# EAGLE board module (EAGLE 9.6.2), part 1 of 2
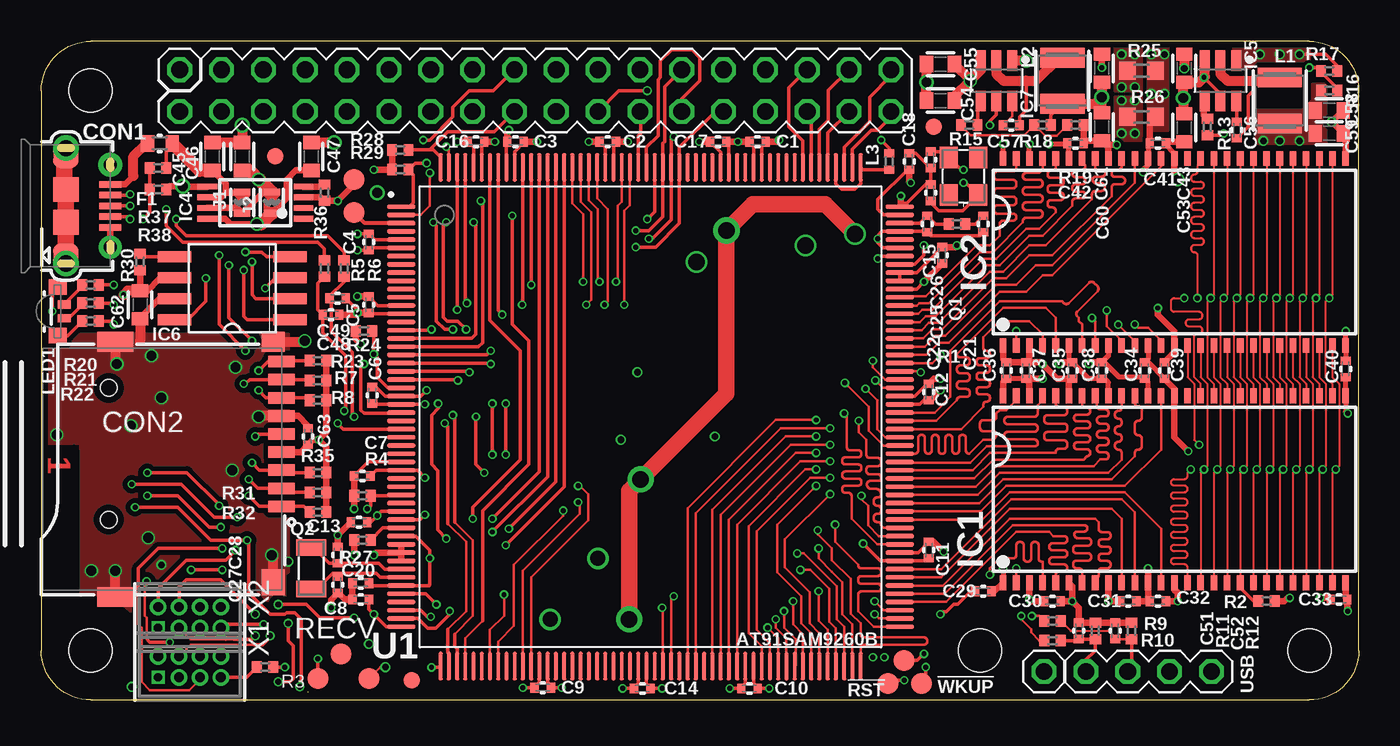
[diagram p5: board, top side]
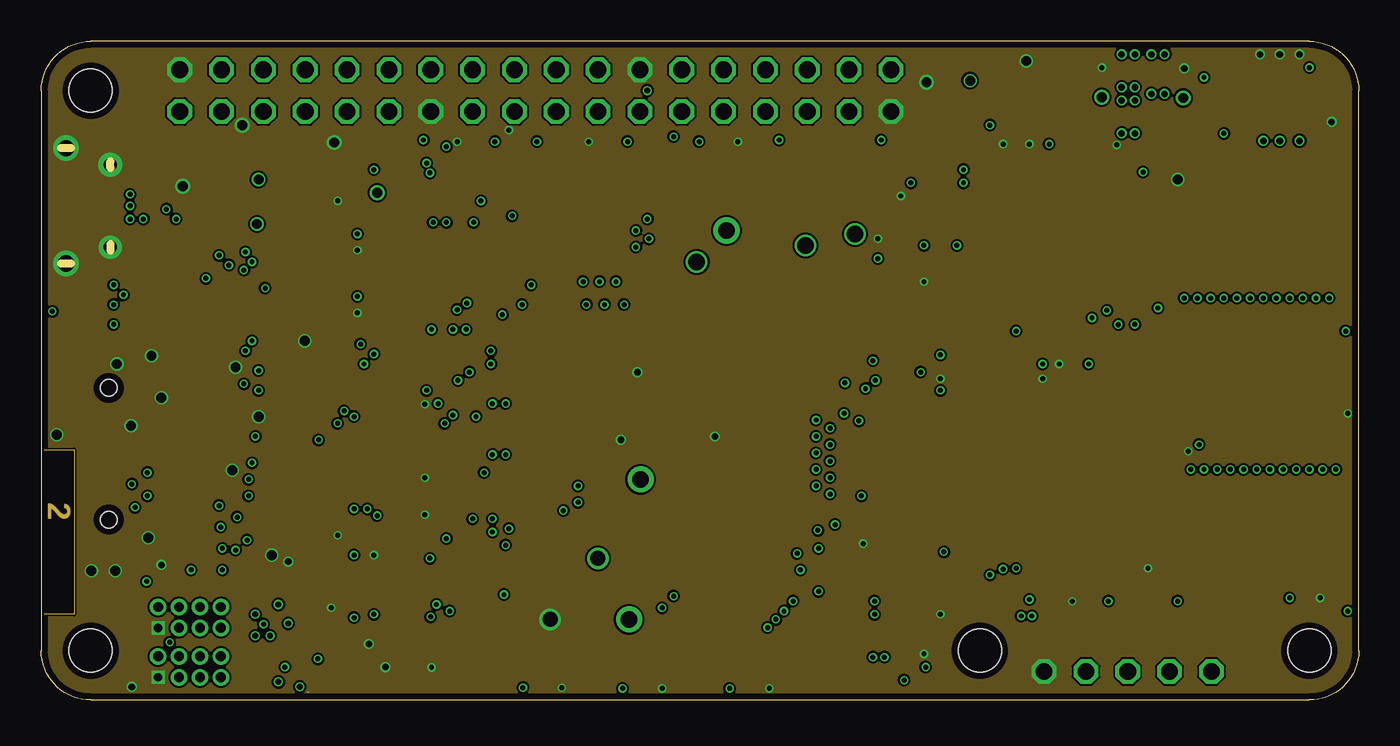
[diagram p6: board, inner layer Route2]
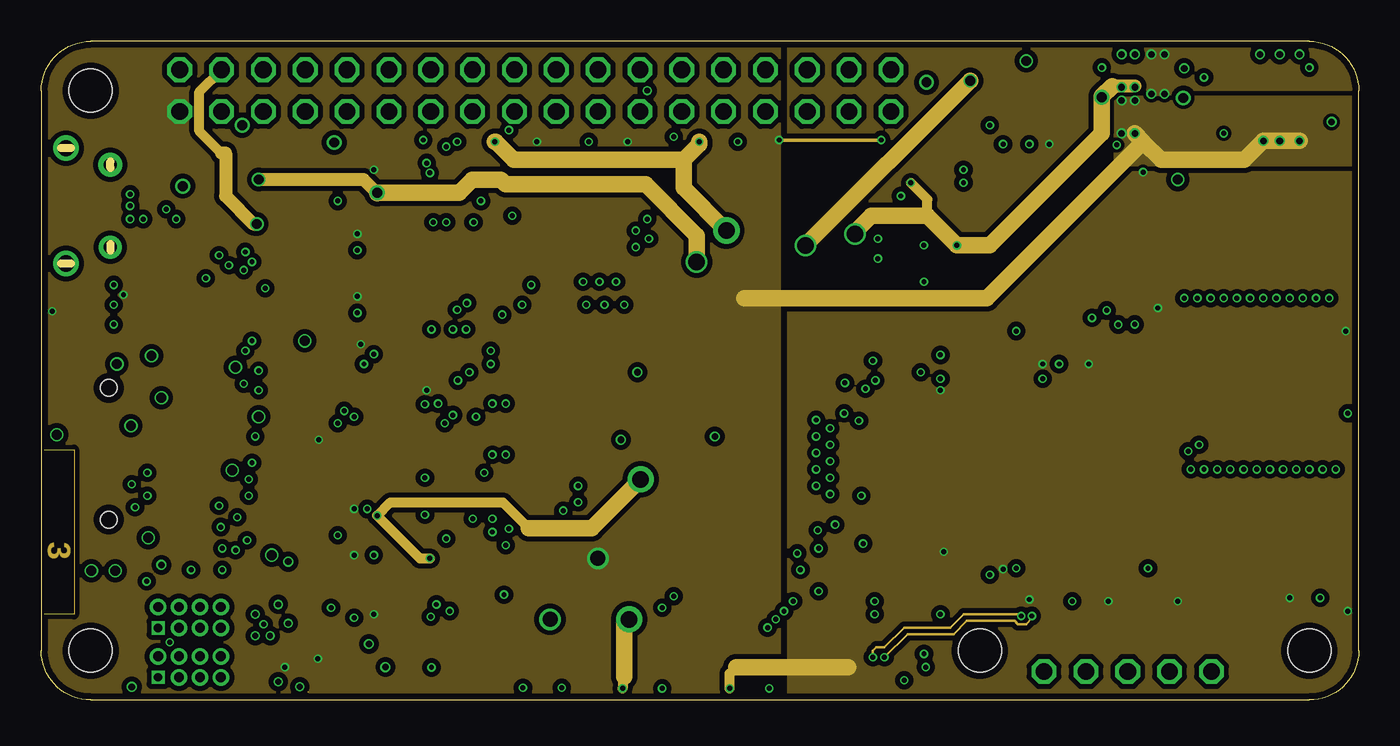
[diagram p7: board, inner layer Route15]
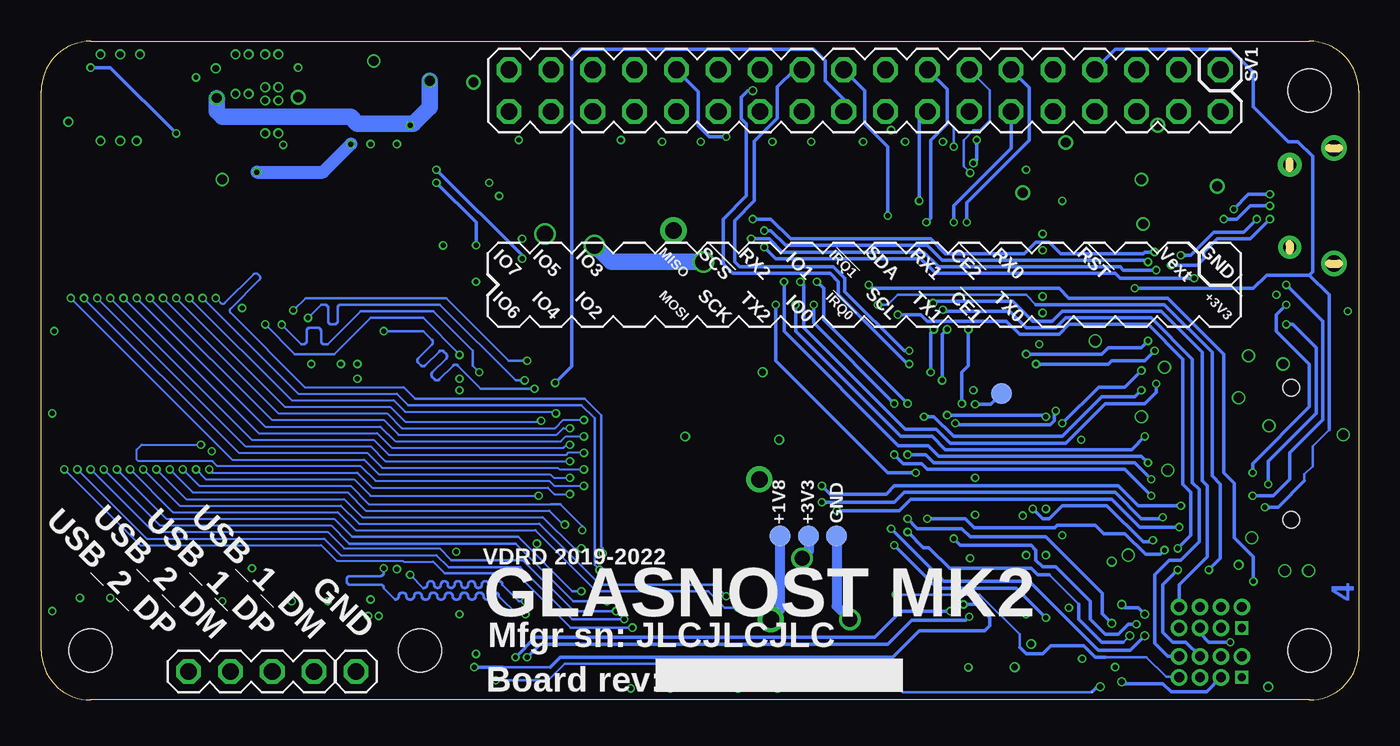
[diagram p8: board, bottom side, seen from below]

Size 80 x 40 mm. Coordinates in mm from the lower left corner, seen from the top.
Outline: 3,0 77,0 arc90 80,3 80,37 arc90 77,40 3,40 arc90 0,37 0,3 arc90 3,0
Copper layers (1+2*15+16): Top 0.035mm / dielectric 0.2mm / Route2 0.0175mm / dielectric 0.465mm / Route15 0.0175mm / dielectric 0.2mm / Bottom 0.035mm
Design rules "default *": minimum track width 5mil, minimum drill 0.2mm, track to track 5mil, track to pad 5mil, pad to pad 5mil, via to via 5mil, smd to smd 5mil, copper to edge 0.4mm, drill to drill 6mil, minimum pad ring 4mil, minimum via ring 4mil, stop-mask expansion 0.1mm, vias tented up to drill 0.4mm, thermal gap 10mil
Holes 2.6 mm at 3,37 3,3 77,3 57,3
tRestrict: area 0,34 to 6,40; area 0,0 to 6,6; area 74,0 to 80,6; area 54,0 to 60,6; area 0,5.2 to 2,15.2
bRestrict: area 0,34 to 6,40; area 0,0 to 6,6; area 74,0 to 80,6; area 54,0 to 60,6; area 0,5.2 to 2,15.2

## Footprints (pad centres in the part's own frame; a part is rotated, then mirrored left to right if it is on the bottom)
B1,27 = smd 1.27 x 1.27: TP 0,0
C0402K = smd 0.5 x 0.6: 1 -0.5,0; 2 0.5,0
C0603 = smd 0.8 x 1: 1 -0.85,0; 2 0.85,0
10118194 = smd 0.4 x 1.35: 1 -1.3,2.7; 2 -0.65,2.7; 3 0,2.7; 4 0.65,2.7; 5 1.3,2.7 | drill 0.8 pad 1.45: SH1 -2.5,2.7 | drill 0.8 pad 1.4: SH2 2.5,2.7 | drill 1 pad 1.55: SH3 -3.5,0; SH8 3.5,0 | smd 1.5 x 1.55: SH4 -3.05,0; SH5 -1,0; SH6 1,0; SH7 3.05,0
112J = smd 1.2 x 1.4: GND1 -7.75,-0.5 | smd 1.2 x 2.2: GND2 -7.75,-10.1; GND3 7.75,-10.1 | smd 1.6 x 1.4: GND4 6.85,-0.5 | smd 0.7 x 1.6: P$1 2.25,0; P$2 1.15,0; P$3 0.05,0; P$4 -1.05,0; P$5 -2.15,0; P$6 -3.25,0; P$7 -4.35,0; P$8 -5.45,0; P$13 -6.55,0 | hole 1: -4.95,-10.5; 3.05,-10.5
F0603 = smd 0.8 x 1: 1 -0.75,0; 2 0.75,0
TSOP54-400 = smd 0.4 x 0.9: 1 -10.4,-5.68; 2 -9.6,-5.68; 3 -8.8,-5.68; 4 -8,-5.68; 5 -7.2,-5.68; 6 -6.4,-5.68; 7 -5.6,-5.68; 8 -4.8,-5.68; 9 -4,-5.68; 10 -3.2,-5.68; 11 -2.4,-5.68; 12 -1.6,-5.68; 13 -0.8,-5.68; 14 0,-5.68; 15 0.8,-5.68; 16 1.6,-5.68; 17 2.4,-5.68; 18 3.2,-5.68; 19 4,-5.68; 20 4.8,-5.68; 21 5.6,-5.68; 22 6.4,-5.68; 23 7.2,-5.68; 24 8,-5.68; 25 8.8,-5.68; 26 9.6,-5.68; 27 10.4,-5.68; 28 10.4,5.68; 29 9.6,5.68; 30 8.8,5.68; 31 8,5.68; 32 7.2,5.68; 33 6.4,5.68; 34 5.6,5.68; 35 4.8,5.68; 36 4,5.68; 37 3.2,5.68; 38 2.4,5.68; 39 1.6,5.68; 40 0.8,5.68; 41 0,5.68; 42 -0.8,5.68; 43 -1.6,5.68; 44 -2.4,5.68; 45 -3.2,5.68; 46 -4,5.68; 47 -4.8,5.68; 48 -5.6,5.68; 49 -6.4,5.68; 50 -7.2,5.68; 51 -8,5.68; 52 -8.8,5.68; 53 -9.6,5.68; 54 -10.4,5.68
TSSOP8 = smd 1.2 x 0.35: 1 -2.925,0.975; 2 -2.925,0.325; 3 -2.925,-0.325; 4 -2.925,-0.975; 5 2.925,-0.975; 6 2.925,-0.325; 7 2.925,0.325; 8 2.925,0.975
SOT95P280X110-6 = smd 1.259 x 0.609: 1 -1.228,0.95; 2 -1.228,0; 3 -1.228,-0.95; 4 1.228,-0.95; 5 1.228,0; 6 1.228,0.95
SO08-208 = smd 0.66 x 2.032: 1 -1.905,-3.498; 2 -0.635,-3.498; 3 0.635,-3.498; 4 1.905,-3.498; 5 1.905,3.498; 6 0.635,3.498; 7 -0.635,3.498; 8 -1.905,3.498
C0603' = smd 0.4 x 1: 1 -0.65,0; 2 0.65,0
L3230M = smd 1.2 x 2.7: 1 -1.4,0; 2 1.4,0
L0402 = smd 0.5 x 0.6: 1 -0.5,0; 2 0.5,0
321015RGB = smd 0.5 x 0.8: 1 -0.415,0.4; 4 0.415,0.4 | smd 0.95 x 1.1: 2 -1.475,0; 3 1.475,0
3215 = smd 1.3 x 1.1: 1 -1.15,-0.9; 2 1.15,-0.9; 3 1.15,0.9; 4 -1.15,0.9
3215' = smd 1 x 1.8: 1 -1.25,0; 2 1.25,0
R0402 = smd 0.6 x 0.7: 1 -0.5,0; 2 0.5,0
R0603 = smd 1 x 1.1: 1 -0.85,0; 2 0.85,0
MA18-2 = drill 1.016 pad 1.5 octagon: 1 -21.59,-1.27; 2 -21.59,1.27; 3 -19.05,-1.27; 4 -19.05,1.27; 5 -16.51,-1.27; 6 -16.51,1.27; 7 -13.97,-1.27; 8 -13.97,1.27; 9 -11.43,-1.27; 10 -11.43,1.27; 11 -8.89,-1.27; 12 -8.89,1.27; 13 -6.35,-1.27; 14 -6.35,1.27; 15 -3.81,-1.27; 16 -3.81,1.27; 17 -1.27,-1.27; 18 -1.27,1.27; 19 1.27,-1.27; 20 1.27,1.27; 21 3.81,-1.27; 22 3.81,1.27; 23 6.35,-1.27; 24 6.35,1.27; 25 8.89,-1.27; 26 8.89,1.27; 27 11.43,-1.27; 28 11.43,1.27; 29 13.97,-1.27; 30 13.97,1.27; 31 16.51,-1.27; 32 16.51,1.27; 33 19.05,-1.27; 34 19.05,1.27; 35 21.59,-1.27; 36 21.59,1.27
QFP50P3120X3120X410-208N = smd 1.74 x 0.28: 1 -15.14,12.75; 2 -15.14,12.25; 3 -15.14,11.75; 4 -15.14,11.25; 5 -15.14,10.75; 6 -15.14,10.25; 7 -15.14,9.75; 8 -15.14,9.25; 9 -15.14,8.75; 10 -15.14,8.25; 11 -15.14,7.75; 12 -15.14,7.25; 13 -15.14,6.75; 14 -15.14,6.25; 15 -15.14,5.75; 16 -15.14,5.25; 17 -15.14,4.75; 18 -15.14,4.25; 19 -15.14,3.75; 20 -15.14,3.25; 21 -15.14,2.75; 22 -15.14,2.25; 23 -15.14,1.75; 24 -15.14,1.25; 25 -15.14,0.75; 26 -15.14,0.25; 27 -15.14,-0.25; 28 -15.14,-0.75; 29 -15.14,-1.25; 30 -15.14,-1.75; 31 -15.14,-2.25; 32 -15.14,-2.75; 33 -15.14,-3.25; 34 -15.14,-3.75; 35 -15.14,-4.25; 36 -15.14,-4.75; 37 -15.14,-5.25; 38 -15.14,-5.75; 39 -15.14,-6.25; 40 -15.14,-6.75; 41 -15.14,-7.25; 42 -15.14,-7.75; 43 -15.14,-8.25; 44 -15.14,-8.75; 45 -15.14,-9.25; 46 -15.14,-9.75; 47 -15.14,-10.25; 48 -15.14,-10.75; 49 -15.14,-11.25; 50 -15.14,-11.75; 51 -15.14,-12.25; 52 -15.14,-12.75; 105 15.14,-12.75; 106 15.14,-12.25; 107 15.14,-11.75; 108 15.14,-11.25; 109 15.14,-10.75; 110 15.14,-10.25; 111 15.14,-9.75; 112 15.14,-9.25; 113 15.14,-8.75; 114 15.14,-8.25; 115 15.14,-7.75; 116 15.14,-7.25; 117 15.14,-6.75; 118 15.14,-6.25; 119 15.14,-5.75; 120 15.14,-5.25; 121 15.14,-4.75; 122 15.14,-4.25; 123 15.14,-3.75; 124 15.14,-3.25; 125 15.14,-2.75; 126 15.14,-2.25; 127 15.14,-1.75; 128 15.14,-1.25; 129 15.14,-0.75; 130 15.14,-0.25; 131 15.14,0.25; 132 15.14,0.75; 133 15.14,1.25; 134 15.14,1.75; 135 15.14,2.25; 136 15.14,2.75; 137 15.14,3.25; 138 15.14,3.75; 139 15.14,4.25; 140 15.14,4.75; 141 15.14,5.25; 142 15.14,5.75; 143 15.14,6.25; 144 15.14,6.75; 145 15.14,7.25; 146 15.14,7.75; 147 15.14,8.25; 148 15.14,8.75; 149 15.14,9.25; 150 15.14,9.75; 151 15.14,10.25; 152 15.14,10.75; 153 15.14,11.25; 154 15.14,11.75; 155 15.14,12.25; 156 15.14,12.75 | smd 0.28 x 1.74: 53 -12.75,-15.14; 54 -12.25,-15.14; 55 -11.75,-15.14; 56 -11.25,-15.14; 57 -10.75,-15.14; 58 -10.25,-15.14; 59 -9.75,-15.14; 60 -9.25,-15.14; 61 -8.75,-15.14; 62 -8.25,-15.14; 63 -7.75,-15.14; 64 -7.25,-15.14; 65 -6.75,-15.14; 66 -6.25,-15.14; 67 -5.75,-15.14; 68 -5.25,-15.14; 69 -4.75,-15.14; 70 -4.25,-15.14; 71 -3.75,-15.14; 72 -3.25,-15.14; 73 -2.75,-15.14; 74 -2.25,-15.14; 75 -1.75,-15.14; 76 -1.25,-15.14; 77 -0.75,-15.14; 78 -0.25,-15.14; 79 0.25,-15.14; 80 0.75,-15.14; 81 1.25,-15.14; 82 1.75,-15.14; 83 2.25,-15.14; 84 2.75,-15.14; 85 3.25,-15.14; 86 3.75,-15.14; 87 4.25,-15.14; 88 4.75,-15.14; 89 5.25,-15.14; 90 5.75,-15.14; 91 6.25,-15.14; 92 6.75,-15.14; 93 7.25,-15.14; 94 7.75,-15.14; 95 8.25,-15.14; 96 8.75,-15.14; 97 9.25,-15.14; 98 9.75,-15.14; 99 10.25,-15.14; 100 10.75,-15.14; 101 11.25,-15.14; 102 11.75,-15.14; 103 12.25,-15.14; 104 12.75,-15.14; 157 12.75,15.14; 158 12.25,15.14; 159 11.75,15.14; 160 11.25,15.14; 161 10.75,15.14; 162 10.25,15.14; 163 9.75,15.14; 164 9.25,15.14; 165 8.75,15.14; 166 8.25,15.14; 167 7.75,15.14; 168 7.25,15.14; 169 6.75,15.14; 170 6.25,15.14; 171 5.75,15.14; 172 5.25,15.14; 173 4.75,15.14; 174 4.25,15.14; 175 3.75,15.14; 176 3.25,15.14; 177 2.75,15.14; 178 2.25,15.14; 179 1.75,15.14; 180 1.25,15.14; 181 0.75,15.14; 182 0.25,15.14; 183 -0.25,15.14; 184 -0.75,15.14; 185 -1.25,15.14; 186 -1.75,15.14; 187 -2.25,15.14; 188 -2.75,15.14; 189 -3.25,15.14; 190 -3.75,15.14; 191 -4.25,15.14; 192 -4.75,15.14; 193 -5.25,15.14; 194 -5.75,15.14; 195 -6.25,15.14; 196 -6.75,15.14; 197 -7.25,15.14; 198 -7.75,15.14; 199 -8.25,15.14; 200 -8.75,15.14; 201 -9.25,15.14; 202 -9.75,15.14; 203 -10.25,15.14; 204 -10.75,15.14; 205 -11.25,15.14; 206 -11.75,15.14; 207 -12.25,15.14; 208 -12.75,15.14
FIDUCIAL_1MM = smd 1 x 1: 1 0,0
MA05-1 = drill 1.016 pad 1.5 octagon: 1 -5.08,0; 2 -2.54,0; 3 0,0; 4 2.54,0; 5 5.08,0
050_610_HN-5/10 = drill 0.5 pad 0.8 square: 1 0,0 | drill 0.6 pad 1: 2 0,1.27; 3 1.27,0; 4 1.27,1.27; 5 2.54,0; 6 2.54,1.27; 7 3.81,0; 8 3.81,1.27

## Placement (x,y rotation side)
!RST  PTR1B1,27  [B1,27]  51.4,1 0 top
!WKUP  PTR1B1,27  [B1,27]  53.45,1 0 top
+1V1  PTR1B1,27  [B1,27]  19,29.6 0 top
+1V8  PTR1B1,27  [B1,27]  35.15,9.95 270 bottom
+3V3  PTR1B1,27  [B1,27]  33.4,9.95 270 bottom
+3V3@99  PTR1B1,27  [B1,27]  16.8,1.3 0 top
C1  100nF  [C0402K]  43.5,33.9 180 top
C2  100nF  [C0402K]  34.4,33.9 180 top
C3  100nF  [C0402K]  28.8,33.9 180 top
C4  100nF  [C0402K]  19.9,27.8 270 top
C5  100nF  [C0402K]  19.9,24 270 top
C6  100nF  [C0402K]  20.1,18.5 270 top
C7  100nF  [C0402K]  19.5,13.6 0 top
C8  100nF  [C0402K]  19.4,6.1 180 top
C9  100nF  [C0402K]  30.45,0.75 0 top
C10  100nF  [C0402K]  43,0.7 0 top
C11  100nF  [C0402K]  53.9,9.1 270 top
C12  100nF  [C0402K]  53.9,18.7 90 top
C13  100nF  [C0402K]  19.3,10.8 180 top
C14  100nF  [C0402K]  36.5,0.7 0 top
C15  100nF  [C0402K]  54.7,27 270 top
C16  100nF  [C0402K]  26.4,33.9 180 top
C17  100nF  [C0402K]  41.1,33.9 0 top
C18  100nF  [C0402K]  52.7,32.7 90 top
C20  100nF  [C0402K]  19.4,7.1 180 top
C21  10nF  [C0402K]  57.2,28.9 270 top
C22  1nF  [C0402K]  53.8,28.9 270 top
C25  9pF  [C0402K]  54,30.8 90 top
C26  9pF  [C0402K]  54,32.8 270 top
C27  15pF  [C0402K]  18,7 270 top
C28  15pF  [C0402K]  18,8.8 90 top
C29  100nF  [C0402K]  57.2,6.6 180 top
C30  100nF  [C0402K]  61.4,6 0 top
C31  100nF  [C0402K]  66,6 0 top
C32  100nF  [C0402K]  67.8,6 180 top
C33  100nF  [C0402K]  78.8,6.1 180 top
C34  100nF  [C0402K]  67,20 90 top
C35  100nF  [C0402K]  62.6,20 90 top
C36  100nF  [C0402K]  58.6,20 270 top
C37  100nF  [C0402K]  59.8,20 270 top
C38  100nF  [C0402K]  64.4,20 270 top
C39  100nF  [C0402K]  68.2,20 270 top
C40  100nF  [C0402K]  79.2,20.1 270 top
C41  100nF  [C0402K]  67.8,33.8 0 top
C42  100nF  [C0402K]  62.8,33.8 0 top
C43  10uF  [C0603]  69.4,38.35 90 top
C45  10uF  [C0603]  10.4,33 90 top
C46  10uF  [C0603]  12.2,33 90 top
C47  10uF  [C0603]  16.4,33 90 top
C48  15pF  [C0402K]  17.6,23.4 0 top
C49  15pF  [C0402K]  18,24.4 0 top
C51  15pF  [C0402K]  63,4.2 90 top
C52  15pF  [C0402K]  65.2,4.2 90 top
C53  10uF  [C0603]  69.4,34.75 270 top
C54  10uF  [C0603]  54.6,36.4 180 top
C55  10uF  [C0603]  54.6,38.6 180 top
C56  1uF  [C0402K]  72.6,34.6 270 top
C57  1uF  [C0402K]  58.9,34.9 0 top
C58  10uF  [C0603]  78.2,35.8 0 top
C59  10uF  [C0603]  78.2,34.4 0 top
C60  10uF  [C0603]  64.4,34.8 270 top
C61  10uF  [C0603]  64.4,38.35 90 top
C62  1uF  [C0603]  6,24 270 top
C63  100nF  [C0402K]  16.2,16 90 top
CON1  microusb  [10118194]  1.5,30 270 top
CON2  microsd  [112J]  14.6,14 270 top
F1  500mA  [F0603]  7.2,33.8 0 top
GND  PTR1B1,27  [B1,27]  31.7,9.95 270 bottom
GND15  PTR1B1,27  [B1,27]  19,31.6 0 top
GND99  PTR1B1,27  [B1,27]  19.9,1.3 0 top
IC1  MT48LC16M16A2  [TSOP54-400]  68.8,12.8 0 top
IC2  MT48LC16M16A2  [TSOP54-400]  68.8,27.2 0 top
IC4  tps2115a  [TSSOP8]  13,30.2 180 top
IC5  [SOT95P280X110-6]  71.6,37.6 270 top
IC6  AT45DB-S  [SO08-208]  11.6,25 90 top
IC7  [SOT95P280X110-6]  58,37.6 270 top
J1  JUMP-0603  [C0603']  12.2,30.2 270 top
J2  JUMP-0603  [C0603']  14,30.2 270 top
L1  4.7uH  [L3230M]  75.2,36.4 270 top
L2  2.2uH  [L3230M]  62,37.6 270 top
L3  300Ohm  [L0402]  51.5,32.7 270 top
LED1  [321015RGB]  1,23.6 270 top
Q1  18.432MHz  [3215]  56,31.8 90 top
Q2  32.768kHz  [3215']  16.4,8 90 top
R1  1k  [R0402]  55.6,28.9 180 top
R2  470k  [R0402]  74.4,6 0 top
R3  47k  [R0402]  13.6,2 0 top
R4  47k  [R0402]  19.5,12.4 0 top
R5  27  [R0402]  17.2,26.2 270 top
R6  27  [R0402]  18.4,26.2 270 top
R7  47k  [R0402]  16.8,19.4 180 top
R8  47k  [R0402]  16.8,18.2 180 top
R9  27  [R0402]  61.4,4.8 0 top
R10  27  [R0402]  61.4,3.6 0 top
R11  dnp  [R0402]  64,4.2 270 top
R12  dnp  [R0402]  66.2,4.2 270 top
R13  75k  [R0402]  70.8,34.8 270 top
R15  120k  [R0402]  56.35,34.9 180 top
R16  40.2k  [R0402]  78.2,37 180 top
R17  13k  [R0402]  78.2,38.2 0 top
R18  40.2k  [R0402]  60.8,34.9 0 top
R19  32.4k  [R0402]  62.8,34.9 0 top
R20  180  [R0402]  3,25.2 180 top
R21  180  [R0402]  3,24.1 180 top
R22  180  [R0402]  3,23 180 top
R23  47k  [R0402]  16.8,20.6 180 top
R24  47k  [R0402]  19.6,22.4 180 top
R25  0/dnp  [R0603]  66.8,38.2 0 top
R26  0/dnp  [R0603]  66.8,35.4 180 top
R27  47k  [R0402]  19.5,9.7 180 top
R28  1k8  [R0402]  21.8,33.4 180 top
R29  1k8  [R0402]  21.8,32.2 180 top
R30  47k  [R0402]  6,26.6 270 top
R31  47k  [R0402]  16.8,12.6 180 top
R32  47k  [R0402]  16.8,11.4 180 top
R35  47k  [R0402]  16.8,13.8 0 top
R36  240  [R0402]  17.2,30.8 90 top
R37  15k  [R0402]  7.1,32.3 0 top
R38  22k  [R0402]  7.1,31 180 top
RECV  PTR1B1,27  [B1,27]  18.2,2.8 0 top
SV1  header  [MA18-2]  30,37 180 bottom
TP3  PTR1B1,27  [B1,27]  52.4,2.4 0 top
TP5  PTR1B1,27  [B1,27]  21.7,18.6 180 bottom
U1  AT91SAM9260-  [QFP50P3120X3120X410-208N]  37,17.2 0 top
U$1  FIDUCIAL  [FIDUCIAL_1MM]  22.5,1.2 0 top
U$2  FIDUCIAL  [FIDUCIAL_1MM]  14.2,33 0 top
U$3  FIDUCIAL  [FIDUCIAL_1MM]  54.2,34.8 0 top
USB  usbhost  [MA05-1]  65.97,1.73 0 top
X1  CONN-1.27-02X04  [050_610_HN-5/10]  7.1,1.38 0 top
X2  CONN-1.27-02X04  [050_610_HN-5/10]  7.1,4.38 0 top